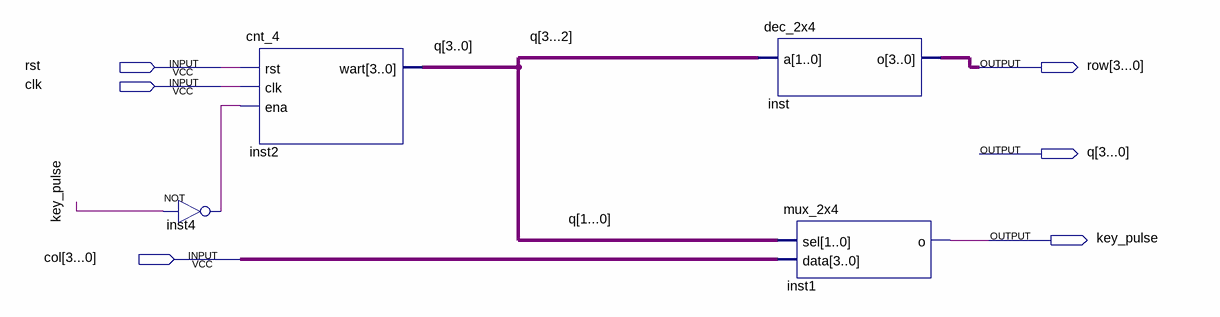
[diagram p0: schematic sheet]
// Quartus schematic schematic.bdf as structural Verilog: 4 symbols, 6 pins
module schematic (
  input  rst,
  input  clk,
  input  \col[3...0] ,
  output \row[3...0] ,
  output \q[3...0] ,
  output key_pulse
);

  wire inst4_out, \q[1...0] , \q[3...2] ;
  wire [3:0] inst_o, q, undriven;

  not inst4 (inst4_out, key_pulse);
  cnt_4 inst2 (.rst(rst), .clk(clk), .ena(inst4_out), .wart(q));
  dec_2x4 inst (.a({2{\q[3...2] }}), .o(inst_o));
  mux_2x4 inst1 (.sel({2{\q[1...0] }}), .data(undriven), .o(key_pulse));
endmodule
